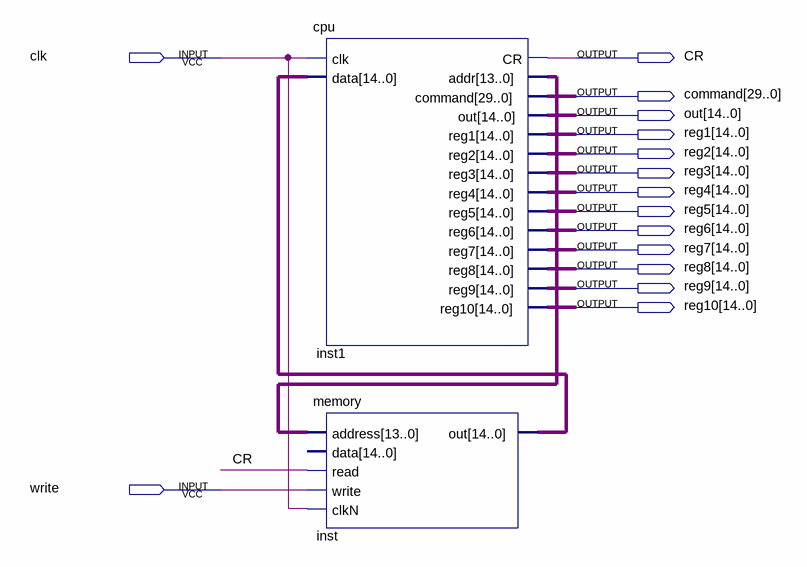
[diagram p0: schematic sheet]
// Quartus schematic curs.bdf as structural Verilog: 2 symbols, 15 pins
module curs (
  input  clk,
  input  write,
  output CR,
  output [29:0] command,
  output [14:0] out,
  output [14:0] reg1,
  output [14:0] reg2,
  output [14:0] reg3,
  output [14:0] reg4,
  output [14:0] reg5,
  output [14:0] reg6,
  output [14:0] reg7,
  output [14:0] reg8,
  output [14:0] reg9,
  output [14:0] reg10
);

  wire [13:0] inst1_addr;
  wire [14:0] inst_out;

  cpu inst1 (
    .clk(clk), .data(inst_out), .CR(CR), .addr(inst1_addr), .command(command), .out(out), .reg1(reg1),
    .reg2(reg2), .reg3(reg3), .reg4(reg4), .reg5(reg5), .reg6(reg6), .reg7(reg7), .reg8(reg8), .reg9(reg9),
    .reg10(reg10));
  memory inst (.address(inst1_addr), .read(CR), .write(write), .clkN(clk), .out(inst_out));  // open: data
endmodule
